# EasyEDA Pro project ProDoc_主板V6.0_2025-09-29.epro, schematic Schematic5_4
Board Name: 主板V6.0; Create Date: 2025-07-02; Page Name: P1; Project Name: 智能车竞赛2025; Schematic Name: Schematic5_4; Update Date: 2025-07-02; Company: 嘉立创EDA; Page Size: A3; Version: V1.0
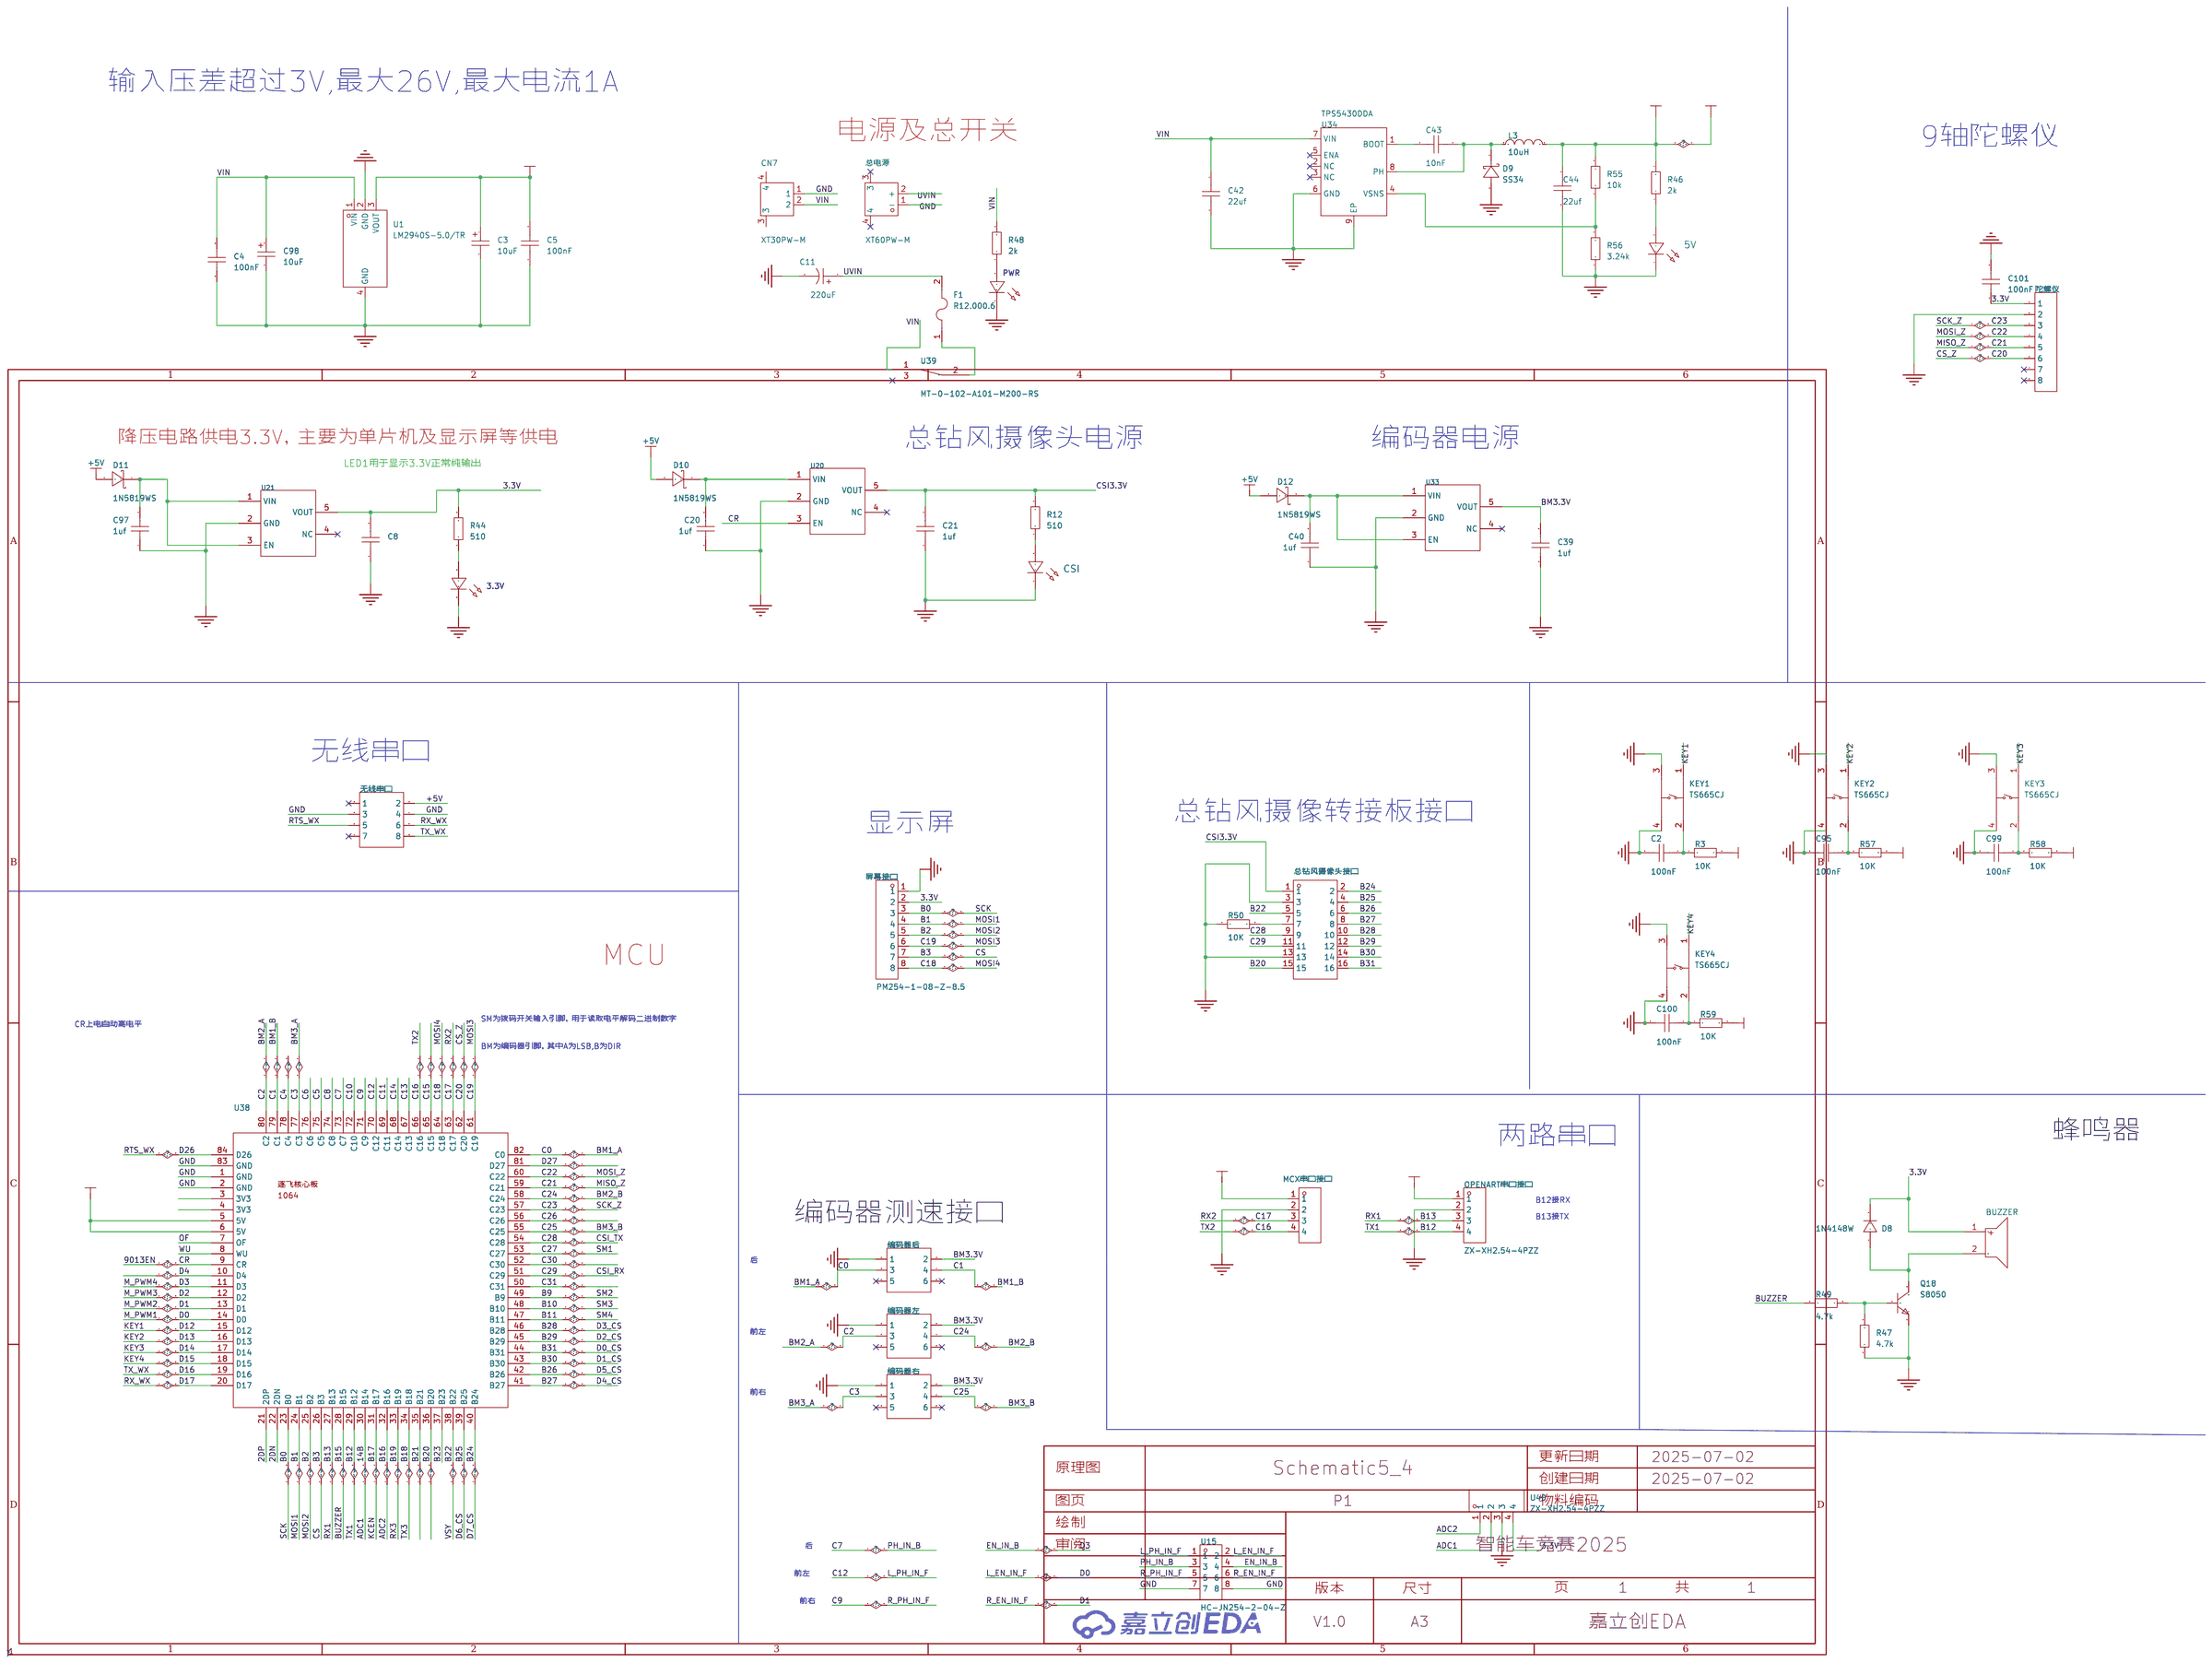
[diagram p0: schematic sheet]

## Parts
3.3V  -  [led_0805]
5V  -  [led_0805]
BUZZER  2.7kHz  [BUZ-SMD_L9.6-W9.6-LS10.0-R]
C2  100nF  [C0603]
C3  10uF  [CAP-SMD_L3.2-W1.6-RD-C7171]
C4  100nF  [C1206]
C5  100nF  [C1206]
C8  1uf  [C0603]
C11  220uF  [CAP-TH_BD8.0-P3.50-D0.5-FD]
C20  1uf  [C0603]
C21  1uf  [C0603]
C39  1uf  [C0603]
C40  1uf  [C0603]
C42  22uf  [C0805]
C43  10nF  [C0805]
C44  22uf  [C0805]
C95  100nF  [C0603]
C97  1uf  [C0603]
C98  10uF  [CAP-SMD_L3.2-W1.6-RD-C7171]
C99  100nF  [C0603]
C100  100nF  [C0603]
C101  100nF  [C0603]
CN7  XT30PW-M  [CONN-TH_XT30PW-M]
CSI  -  [led_0805]
D8  1N4148W  [SOD-123_L2.8-W1.8-LS3.7-RD]
D9  SS34  [SMA_L4.3-W2.5-LS5.0-RD]
D10  1N5819WS  [SOD-323_L1.8-W1.3-LS2.5-RD]
D11  1N5819WS  [SOD-323_L1.8-W1.3-LS2.5-RD]
D12  1N5819WS  [SOD-323_L1.8-W1.3-LS2.5-RD]
F1  R12.000.6  [F1206]
KEY1  TS665CJ  [SW-TH_4P-L6.0-W6.0-P4.50-LS6.5]
KEY2  TS665CJ  [SW-TH_4P-L6.0-W6.0-P4.50-LS6.5]
KEY3  TS665CJ  [SW-TH_4P-L6.0-W6.0-P4.50-LS6.5]
KEY4  TS665CJ  [SW-TH_4P-L6.0-W6.0-P4.50-LS6.5]
L3  10uH  [IND-SMD_L5.4-W5.2_FXL0530]
MCX串口接口  ZX-XH2.54-4PZZ  [CONN-TH_4P-P2.50_4PIN]
OPENART串口接口  ZX-XH2.54-4PZZ  [CONN-TH_4P-P2.50_4PIN]
PWR  -  [led_0805]
Q18  S8050  [SOT-23-3_L2.9-W1.3-P1.90-LS2.4-BR]
R3  10K  [R0603]
R12  510  [R0805]
R44  510  [R0805]
R46  2k  [R0805]
R47  4.7k  [R0805]
R48  2k  [R0805]
R49  4.7k  [R0805]
R50  10K  [R0805]
R55  10k  [R0805]
R56  3.24k  [R0805]
R57  10K  [R0603]
R58  10K  [R0603]
R59  10K  [R0603]
U1  LM2940S-5.0/TR  [TO-263-3_L8.6-W10.2-P2.54-LS14.4-BR]
U15  HC-JN254-2-04-Z  [IDC-TH_8P-P2.54-V-R2-C4-S2.54]
U20  RT9013-33GB  [SOT-23-5_L3.0-W1.7-P0.95-LS2.8-BL]
U21  RT9013-33GB  [SOT-23-5_L3.0-W1.7-P0.95-LS2.8-BL]
U33  RT9013-33GB  [SOT-23-5_L3.0-W1.7-P0.95-LS2.8-BL]
U34  TPS5430DDA  [ESOP-8_L4.9-W3.9-P1.27-LS6.0-BL-EP-2]
U38  -  [NXPRT1064]
U39  MT-0-102-A101-M200-RS  [SW-TH_MT-0-103-A101-M200-RS]
U40  ZX-XH2.54-4PZZ  [CONN-TH_4P-P2.50_4PIN]
屏幕接口  PM254-1-08-Z-8.5  [HDR-TH_8P-P2.54-V-F]
总电源  XT60PW-M  [CONN-TH_XT60PW-M]
总钻风摄像头接口  PM254-2-08-Z-8.5  [HDR-TH_16P-P2.54-V-F-R2-C8-S2.54]
无线串口  -  [HDR-TH_8P-P2.54-V-F-R2-C4-S2.54-1]
编码器右  -  [HDR-TH_6P-P2.54-V-F-R2-C3-S2.54]
编码器后  -  [HDR-TH_6P-P2.54-V-F-R2-C3-S2.54]
编码器左  -  [HDR-TH_6P-P2.54-V-F-R2-C3-S2.54]
陀螺仪  -  [HDR-TH_8P-P2.54-V-F-1]

## Library data of the parts
3.3V = LED_0805-G: Supplier Footprint: 0805
5V CSI = LED_0805-R: Supplier Footprint: 0805
BUZZER = MLT-9650: 驱动方式:有源(内含驱动线路);构造类型:电磁式;频率:2.7kHz;声压(SPL):85dB@5V,10cm;; LCSC Part Name: 耐环保MLT-9650; Supplier Part: C96127; Manufacturer: 华能; JLCPCB Part Class: 扩展库; Datasheet: https://atta.szlcsc.com/upload/public/pdf/source/20170914/C96127_1505374148680969227.pdf; Supplier: LCSC; Oscillator Circuit: 有源(内含驱动线路); Technology Type: 电磁式; Operating Voltage: 3V~7V; Sound Pressure Level (SPL): 85dB@5V,10cm; Length: 9.6mm; Width: 9.6mm; Height: 5.5mm
C2 C8 C20 C21 C39 C40 C95 C97 C99-C101 = CAP_0603: Supplier Footprint: 0603
C3 C98 = TAJA106K016RNJ: 容值:10uF;精度:±10%;额定电压:16V;等效串联电阻:3Ω@100kHz;; LCSC Part Name: 10uF ±10% 16V; Supplier Part: C7171; Manufacturer: Kyocera AVX; Supplier Footprint: CASE-A-3216; JLCPCB Part Class: 基础库; Datasheet: https://atta.szlcsc.com/upload/public/pdf/source/20160107/1457707750344.pdf; Supplier: LCSC; Tolerance: ±10%; Rated Voltage: 16V; Equivalent Series Resistance(ESR): 3Ω@100kHz; Operating Temperature: -55℃~+125℃
C4 C5 = CAP_1206: Supplier Footprint: 1206
C11 = KNH2220UF35V149EC0049: 容值:220uF;精度:±20%;额定电压:35V;纹波电流:1.7A@100kHz;等效串联电阻:40mΩ@100kHz;; LCSC Part Name: 220uF ±20% 35V; Supplier Part: C2981462; Manufacturer: KNSCHA(科尼盛); Supplier Footprint: 插件,D8xL9mm; JLCPCB Part Class: 扩展库; Datasheet: https://atta.szlcsc.com/upload/public/pdf/source/20220426/9FC8A158D93B909CC105160B4A0CB698.pdf; Supplier: LCSC; Tolerance: ±20%; Rated Voltage: 35V; Ripple Current: 1.7A@100kHz; Equivalent Series Resistance(ESR): 40mΩ@100kHz; Lead Spacing: 3.5mm; φD: 8mm; L: 9mm; Lifetime @ Temp: 2000hrs@105℃; Operating Temperature: -55℃~+105℃
C42-C44 = CAP_0805: Supplier Footprint: 0805
CN7 = XT30PW-M: 类别:-;类型1:-;; LCSC Part Name: AMASS(艾迈斯)航模插头 卧式弯脚 XT30PW-M公头; Supplier Part: C431092; Manufacturer: AMASS(艾迈斯); JLCPCB Part Class: 扩展库; Datasheet: https://atta.szlcsc.com/upload/public/pdf/source/20220222/6A9F22F7850E25B33E1BE430ADF8560B.pdf; Supplier: LCSC; Brand: 艾迈斯; Type: 航模插头; RatedVoltage: DC 500V; InterfaceType: 公头; RatedCurrent: 15A; RecommendedWireGauge: 16/18/20AWG; contact resistance: 1.2mΩ; specifications: 2pin
D8 = 1N4148W_C2099: 二极管配置:独立式;正向压降(Vf):1.25V@150mA;直流反向耐压(Vr):100V;平均整流电流(Io):150mA;功率:500mW;反向恢复时间(trr):4ns;; LCSC Part Name: 电压:100V 电流:150mA; Supplier Part: C2099; Manufacturer: CJ(江苏长电/长晶); Supplier Footprint: SOD-123; JLCPCB Part Class: 扩展库; Datasheet: https://atta.szlcsc.com/upload/public/pdf/source/20120428/1457706480199.pdf; Supplier: LCSC; Diode Configuration: 独立式; Forward Voltage (Vf@If): 1.25V@150mA; Reverse Voltage (Vr): 100V; Average Rectified Current (Io): 150mA; Power Dissipation: 500mW; Reverse Leakage Current: 1uA@75V; Reverse Recovery Time (trr): 4ns
D9 = SS34_C727060: 二极管配置:独立式;正向压降(Vf):550mV@3A;直流反向耐压(Vr):40V;平均整流电流(Io):3A;; LCSC Part Name: 电压:40V 电流:3A; Supplier Part: C727060; Manufacturer: TWGMC(台湾迪嘉); Supplier Footprint: SMA(DO-214AC); JLCPCB Part Class: 扩展库; Datasheet: https://atta.szlcsc.com/upload/public/pdf/source/20200828/C727059_6599B6CAC5F3238B9C33E46794659DBE.pdf; Supplier: LCSC; Diode Configuration: 独立式; Forward Voltage (Vf@If): 550mV@3A; Reverse Voltage (Vr): 40V; Average Rectified Current (Io): 3A; Reverse Leakage Current (Ir): 500uA@40V
D10-D12 = 1N5819WS_C191023: 正向压降(Vf):600mV@1A;直流反向耐压(Vr):40V;整流电流:1A;; LCSC Part Name: 电压:40V 电流:1A; Supplier Part: C191023; Manufacturer: Hottech(合科泰); Supplier Footprint: SOD-323; JLCPCB Part Class: 基础库; Datasheet: https://atta.szlcsc.com/upload/public/pdf/source/20220428/3CB86FD8D28D653594B4E35F9D5AEFD9.pdf; Supplier: LCSC; Forward Voltage (Vf@If): 600mV@1A; Reverse Voltage (Vr): 40V; Rectified Current: 1A
F1 = R12.000.6: 类型:贴片式保险丝;额定电流:6A;; LCSC Part Name: 1206快断 48V 6A 贴片保险丝; Supplier Part: C5383191; Manufacturer: Reomax(瑞迈); Supplier Footprint: 1206; JLCPCB Part Class: 扩展库; Datasheet: https://atta.szlcsc.com/upload/public/pdf/source/20230322/8B7334A9365A6D3E55286A2E42090C87.pdf; Supplier: LCSC; Type: 贴片式保险丝; Current Rating: 6A
KEY1-KEY4 = TS665CJ: 电路结构:单刀单掷;按钮形状:圆形按钮;安装方式:直插;开关长度:6mm;开关宽度:6mm;开关高度:5mm;触点电流:50mA;额定电压(DC):12V;带灯:-;机械寿命:-;; LCSC Part Name: 6*6*5mm 直插 轻触开关; Supplier Part: C393938; Manufacturer: SHOU HAN(首韩); Supplier Footprint: 插件; JLCPCB Part Class: 扩展库; Datasheet: https://atta.szlcsc.com/upload/public/pdf/source/20190521/C393938_BDABEAC600B4C55E200A80AA129B70BC.pdf; Supplier: LCSC; Circuit: 单刀单掷; Actuator Style: 圆形按钮; Mounting Style: 直插; Switch Length: 6mm; Switch Width: 6mm; Switch Height: 5mm; Contact Current: 50mA; Voltage Rating (DC): 12V
L3 = FXL0530-100-M: 电感值:10uH;精度:±20%;额定电流:3.2A;饱和电流(Isat):3.5A;类型:一体成型电感;; LCSC Part Name: 10uH ±20% 3.5A; Supplier Part: C177248; Manufacturer: cjiang(长江微电); Supplier Footprint: SMD,5.2x5.4mm; JLCPCB Part Class: 扩展库; Datasheet: https://atta.szlcsc.com/upload/public/pdf/source/20230516/4BF6F9C76E81720F52A39ED5FFFA18B4.pdf; Supplier: LCSC; Tolerance: ±20%; Rated Current: 3.2A; Saturation Current (Isat): 3.5A; DC Resistance (DCR): 125mΩ; Type: 一体成型电感
MCX串口接口 OPENART串口接口 U40 = ZX-XH2.54-4PZZ: 插针结构:1x4P;间距:2.54mm;安装方式:直插;参考系列:XH;总PIN数:4P;排数:1;每排PIN数:4;行距:-;额定电流:3A;触头材质:黄铜;触头镀层:锡;工作温度范围:-25℃~+85℃;; Supplier Part: C7429634; Manufacturer: Megastar(兆星); Supplier Footprint: 插件,P=2.54mm; JLCPCB Part Class: 扩展库; Datasheet: https://atta.szlcsc.com/upload/public/pdf/source/20230619/B529A2163E0159A644AB3383D208FB03.pdf; Supplier: LCSC; Pins Structure: 1x4P; Pitch: 2.54mm; Mounting Style: 直插; Reference Series: XH; Number of Pins: 4P; Number of Rows: 1; Number of PINs Per Row: 4; Current Rating (Max): 3A; Contact Material: 黄铜; Contact Plating: 锡; Operating Temperature Range: -25℃~+85℃
PWR = LED_0805-B: Supplier Footprint: 0805
Q18 = S8050_C2891804: 晶体管类型:NPN;集电极电流(Ic):500mA;集射极击穿电压(Vceo):25V;功率(Pd):300mW;; LCSC Part Name: NPN 电流:500mA 耐压:25V; Supplier Part: C2891804; Manufacturer: YONGYUTAI(永裕泰); Supplier Footprint: SOT-23; JLCPCB Part Class: 扩展库; Datasheet: https://atta.szlcsc.com/upload/public/pdf/source/20210901/5347316A10609C628D4D69AE01446E5B.pdf; Supplier: LCSC; Transistor Type: NPN; Collector Current (Ic): 500mA; Collector-Emitter Breakdown Voltage (Vceo): 25V; Power Dissipation (Pd): 300mW; Collector Cut-Off Current (Icbo): 1uA; Collector-Emitter Saturation Voltage (VCE(sat)@Ic,Ib): 500mV@500mA,50mA
R3 R48 R57-R59 = Res_0603: Supplier Footprint: 0603
R12 R44 R46 R47 R49 R50 R55 R56 = Res_0805: Supplier Footprint: 0805
U1 = LM2940S-5.0/TR: 输出类型:固定;最大输入电压:26V;输出电压:5V;最大输出电流:1A;电源纹波抑制比(PSRR):60dB@(120Hz);输出极性:正极;; LCSC Part Name: 输入26V 输出5V 1A; Supplier Part: C434496; Manufacturer: HGSEMI(华冠); Supplier Footprint: TO-263-3L; JLCPCB Part Class: 扩展库; Datasheet: https://atta.szlcsc.com/upload/public/pdf/source/20220118/FAC7234A0BE9BED821FF13FB6224EF1A.pdf; Supplier: LCSC; Output Type: 固定; Maximum Input Voltage: 26V; Output Voltage: 5V; MAX Output Current: 1A; Power Supply Rejection Ratio (PSRR): 60dB@(120Hz); Dropout Voltage: 1V@(1A); Output Polarity: 正极; Number of Outputs: 1
U15 = HC-JN254-2-04-Z: 连接器类型:简牛座;间距:2.54mm;结构:2x4P;额定电流:3A;额定电压:-;封装形式:直插;行距:2.54mm;排数:2;每排PIN数:4;触头材质:黄铜;触头镀层:金;工作温度范围:-40℃~+105℃;焊接温度(最大值):260℃@10S;; LCSC Part Name: 2.54mm 2x4P 排数:2 每排P数:4; Supplier Part: C5372864; Manufacturer: HCTL(华灿天禄); Supplier Footprint: 插件,P=2.54mm; JLCPCB Part Class: 扩展库; Datasheet: https://atta.szlcsc.com/upload/public/pdf/source/20230314/29278A24539954283B80828B9C32CD4C.pdf; Supplier: LCSC; Connector Type: 简牛座; Pitch: 2.54mm; Structure: 2x4P; Current Rating (Max): 3A; Holder Type: 直插; Row Spacing: 2.54mm; Number of Rows: 2; Pin Number in each Row: 4; Contact Material: 黄铜; Contact Plating: 金; Operating Temperature Range: -40℃~+105℃; Soldering Temperature(Max): 260℃@10S
U20 U21 U33 = RT9013-33GB: 输出类型:固定;输出极性:正;最大输入电压:5.5V;输出电压:3.3V;输出电流:500mA;电源纹波抑制比(PSRR):50dB@(10kHz);; LCSC Part Name: 输入5.5V 输出3.3V 500mA; Supplier Part: C47773; Manufacturer: RICHTEK(立锜); Supplier Footprint: SOT-23-5; JLCPCB Part Class: 扩展库; Datasheet: https://atta.szlcsc.com/upload/public/pdf/source/20150504/1457707282459.pdf; Supplier: LCSC; Output Type: 固定; Output Polarity: 正; Number of Outputs: 1; Maximum Input Voltage: 5.5V; Output Voltage: 3.3V; Dropout Voltage: 400mV@(500mA); Quiescent Current (Ground Current): 50uA; Output Current: 500mA; Power Supply Rejection Ratio (PSRR): 50dB@(10kHz); Operating Temperature: -40℃~+85℃
U34 = TPS5430DDA: 功能类型:降压型;输出类型:可调;输入电压:5.5V~36V;输出电压:1.221V~32.04V;输出电流(最大值):3A;; LCSC Part Name: 降压 3A 36V; Supplier Part: C502477; Manufacturer: TI(德州仪器); Supplier Footprint: ESOP-8; JLCPCB Part Class: 扩展库; Datasheet: https://www.ti.com/cn/lit/gpn/tps5430; Supplier: LCSC; Function: 降压型; Output Type: 可调; Input Voltage: 5.5V~36V; Output Voltage: 1.221V~32.04V; Output Current (Max): 3A; Switching Frequency: 500kHz; Operating Temperature: -40℃~+125℃@(TJ); Synchronous Rectification: 否; Number of Outputs: 1; Topology: 降压式; Switch tube (built-in/external): 内置
U38 = NXP_1064
U39 = MT-0-102-A101-M200-RS: 电路结构:单刀双掷;机械寿命:-;额定电流:5A;额定电压(AC):125V;安装方式:直插;; LCSC Part Name: 小型钮子三脚二档 五件套; Supplier Part: C1788492; Manufacturer: YUEN FUNG(源丰); Supplier Footprint: 插件; JLCPCB Part Class: 扩展库; Datasheet: https://atta.szlcsc.com/upload/public/pdf/source/20230720/8E5C36EFDF374AE4FF4AC09DB233CE0E.pdf; Supplier: LCSC; Circuit: 单刀双掷; Switch Length: 13mm; Switch Width: 8mm; Switch Height: 28.6mm; Contact Current: 5A; Voltage Rating (AC): 125V; Actuator Type: 圆柱钮柄; Pin Style: 焊片; Mounting Style: 直插; Operating Temperature: -25℃~+85℃
屏幕接口 = PM254-1-08-Z-8.5: 排数:单排;总孔位数:8P;间距:2.54mm;插孔结构:1x8P;行距:-;安装类型:直插;圆孔/方孔:方孔;额定电流:3A;额定电压:-;插孔方向:顶部;塑高:8.5mm;工作温度范围:-40℃~+105℃;; LCSC Part Name: 间距:2.54mm 1x8P 直插; Supplier Part: C2897371; Manufacturer: HCTL(华灿天禄); Supplier Footprint: 插件,P=2.54mm; JLCPCB Part Class: 扩展库; Datasheet: https://atta.szlcsc.com/upload/public/pdf/source/20230609/534BE42964C679BDE98E061007C4ABD6.pdf; Supplier: LCSC; Number of Rows: 单排; Number of Holes: 8P; Pitch: 2.54mm; Holes Structure: 1x8P; Mounting Type: 直插; Circular Hole / Square Hole: 方孔; Current Rating (Max): 3A; Holes Direction: 顶部; Insulation Height: 8.5mm; Operating Temperature Range: -40℃~+105℃
总电源 = XT60PW-M: 类别:-;类型1:-;; LCSC Part Name: AMASS(艾迈斯)航模插头xt60连接器150公母对接pw锂电池公头 板插卧式XT60PW-M; Supplier Part: C98732; Manufacturer: AMASS(艾迈斯); JLCPCB Part Class: 扩展库; Datasheet: https://atta.szlcsc.com/upload/public/pdf/source/20240118/44A3DCFF53BE25DC65378AFFB21277A4.pdf; Supplier: LCSC; Brand: 艾迈斯; Type: 卧式插头; Colour: 黄色; InterfaceType: 公头
总钻风摄像头接口 = PM254-2-08-Z-8.5: 排数:双排;总孔位数:16P;间距:2.54mm;插孔结构:2x8P;行距:2.54mm;安装类型:直插;圆孔/方孔:方孔;额定电流:3A;额定电压:-;插孔方向:顶部;塑高:8.5mm;工作温度范围:-40℃~+105℃;; LCSC Part Name: 间距:2.54mm 2x8P 直插; Supplier Part: C2897409; Manufacturer: HCTL(华灿天禄); Supplier Footprint: 插件,P=2.54mm; JLCPCB Part Class: 扩展库; Datasheet: https://atta.szlcsc.com/upload/public/pdf/source/20230609/3D36CA2C1BFC9FD1C3F709AD9DFEB9C2.pdf; Supplier: LCSC; Number of Rows: 双排; Number of Holes: 16P; Pitch: 2.54mm; Holes Structure: 2x8P; Row Spacing: 2.54mm; Mounting Type: 直插; Circular Hole / Square Hole: 方孔; Current Rating (Max): 3A; Holes Direction: 顶部; Insulation Height: 8.5mm; Operating Temperature Range: -40℃~+105℃
无线串口 = HDR-F_2.54_2x4: Supplier Part: C92271; Supplier Footprint: 插件
编码器右 编码器后 编码器左 = HDR-F_2.54_2x3: Supplier Part: C92272; Supplier Footprint: 插件
陀螺仪 = HDR-F_2.54_1x8P: Supplier Part: C27438; Supplier Footprint: 插件

## Nets
3.3V: BUZZER.1 C8.2 C101.1 D8.1(K) R3.2 R44.2 R57.2 R58.2 R59.2 U21.5(VOUT) U40.4 屏幕接口.2 陀螺仪.1
+5V: C44.1 D10.2(A) D11.2(A) D12.2(A) L3.2 MCX串口接口.1 OPENART串口接口.1 R46.2 R55.2 无线串口.2
+5V_1064: C3.1 C5.2 U1.3(VOUT) U38.5(5V) U38.6(5V)
GND: 3.3V.1(C) 5V.1(C) C2.2 C3.2 C4.1 C5.1 C8.1 C11.2 C20.1 C21.1 C39.1 C40.1 C42.2 C44.2 C95.2 C97.1 C98.2 C99.2 C100.2 C101.2 CN7.1 CSI.1(C) D9.2(A) KEY1.3(C) KEY1.4(D) KEY2.3(C) KEY2.4(D) KEY3.3(C) KEY3.4(D) KEY4.3(C) KEY4.4(D) MCX串口接口.2 OPENART串口接口.2 PWR.1(C) Q18.2(E) R47.1 R50.1 R56.1 U1.2(GND) U1.4(GND) U15.7 U15.8 U20.2(GND) U21.2(GND) U33.2(GND) U34.6(GND) U34.9(EP) U38.1(GND) U38.2(GND) U38.83(GND) U40.3 屏幕接口.1 总电源.1(-) 总钻风摄像头接口.3 总钻风摄像头接口.13 无线串口.3 无线串口.4 编码器右.1 编码器后.1 编码器左.1 陀螺仪.2
VIN: C4.2 C42.1 C98.1 CN7.2 R48.2 U1.1(VIN) U34.7(VIN) U39.1
2DN: U38.22(2DN)
2DP: U38.21(2DP)
14B: U38.30(B14) U40.2
9013EN: U20.3(EN) U38.9(CR)
ADC2: U38.32(B16) U40.1
B0: U38.23(B0) 屏幕接口.3
B1: U38.24(B1) 屏幕接口.4
B2: U38.25(B2) 屏幕接口.5
B3: U38.26(B3) 屏幕接口.7
B9: U38.49(B9)
B10: U38.48(B10)
B11: U38.47(B11)
B12: OPENART串口接口.4 U38.29(B12)
B13: OPENART串口接口.3 U38.27(B13)
B15: R49.1 U38.28(B15)
B17: U38.31(B17)
B18: U38.34(B18)
B19: U38.33(B19)
B20: U38.36(B20) 总钻风摄像头接口.15
B21: U38.35(B21)
B22: U38.38(B22) 总钻风摄像头接口.5
B23: U38.37(B23)
B24: U38.40(B24) 总钻风摄像头接口.2
B25: U38.39(B25) 总钻风摄像头接口.4
B26: U38.42(B26) 总钻风摄像头接口.6
B27: U38.41(B27) 总钻风摄像头接口.8
B28: U38.46(B28) 总钻风摄像头接口.10
B29: U38.45(B29) 总钻风摄像头接口.12
B30: U38.43(B30) 总钻风摄像头接口.14
B31: U38.44(B31) 总钻风摄像头接口.16
BM1_A: U38.82(C0) 编码器后.3
BM1_B: U38.79(C1) 编码器后.4
BM2_A: U38.80(C2) 编码器左.3
BM2_B: U38.58(C24) 编码器左.4
BM3.3V: C39.2 U33.5(VOUT) 编码器右.2 编码器后.2 编码器左.2
BM3_A: U38.77(C3) 编码器右.3
BM3_B: U38.55(C25) 编码器右.4
C4: U38.78(C4)
C5: U38.75(C5)
C6: U38.76(C6)
C7: U15.3 U38.73(C7)
C8: U38.74(C8)
C9: U15.5 U38.71(C9)
C10: U38.72(C10)
C11: U38.69(C11)
C12: U15.1 U38.70(C12)
C13: U38.67(C13)
C14: U38.68(C14)
C15: U38.65(C15)
C16: MCX串口接口.4 U38.66(C16)
C17: MCX串口接口.3 U38.63(C17)
C18: U38.64(C18) 屏幕接口.8
C19: U38.61(C19) 屏幕接口.6
C20: U38.62(C20) 陀螺仪.6
C21: U38.59(C21) 陀螺仪.5
C22: U38.60(C22) 陀螺仪.4
C23: U38.57(C23) 陀螺仪.3
C26: U38.56(C26)
C27: U38.53(C27)
C28: U38.54(C28) 总钻风摄像头接口.9
C29: U38.51(C29) 总钻风摄像头接口.11
C30: U38.52(C30)
C31: U38.50(C31)
CSI3.3V: C21.2 R12.2 U20.5(VOUT) 总钻风摄像头接口.1
D0: U15.2 U38.14(D0)
D1: U15.6 U38.13(D1)
D2: U38.12(D2)
D3: U15.4 U38.11(D3)
D4: U38.10(D4)
D12: KEY1.1(A) U38.15(D12)
D13: KEY2.1(A) U38.16(D13)
D14: KEY3.1(A) U38.17(D14)
D15: KEY4.1(A) U38.18(D15)
D16: U38.19(D16) 无线串口.8
D17: U38.20(D17) 无线串口.6
D26: U38.84(D26) 无线串口.5
D27: U38.81(D27)
OF: U38.7(OF)
UVIN: C11.1 F1.2 总电源.2(+)
WU: U38.8(WU)
$1N3498: PWR.2(A) R48.1
$1N3640: R50.2 总钻风摄像头接口.7
$1N3710: Q18.1(B) R47.2 R49.2
$1N3711: BUZZER.2 D8.2(A) Q18.3(C)
$1N3941: C40.2 D12.1(K) U33.1(VIN) U33.3(EN)
$1N3969: C97.2 D11.1(K) U21.1(VIN) U21.3(EN)
$1N3994: 3.3V.2(A) R44.1
$1N4005: CSI.2(A) R12.1
$1N4007: F1.1 U39.2
$1N9076: 5V.2(A) R46.1
$1N9079: C43.1 U34.1(BOOT)
$1N9081: C43.2 D9.1(C) L3.1 U34.8(PH)
$1N9082: R55.1 R56.2 U34.4(VSNS)
$1N17911: C20.2 D10.1(K) U20.1(VIN)
$1N37221: C2.1 KEY1.2(B) R3.1
$1N37227: C95.1 KEY2.2(B) R57.1
$1N37371: C99.1 KEY3.2(B) R58.1
$1N37512: C100.1 KEY4.2(B) R59.1

Not connected (* = marked no-connect by the designer): CN7 3 4; U20 4(NC)*; U21 4(NC)*; U33 4(NC)*; U34 2(NC)* 3(NC)* 5(ENA)*; U38 3(3V3) 4(3V3); U39 3*; 总电源 3* 4*; 无线串口 1* 7*; 编码器右 5* 6*; 编码器后 5* 6*; 编码器左 5* 6*; 陀螺仪 7* 8*

## Notes on the sheet
- 输入压差超过3V,最大26V,最大电流1A
- 电源及总开关
- 9轴陀螺仪
- 降压电路供电3.3V，主要为单片机及显示屏等供电
- 总钻风摄像头电源
- 编码器电源
- LED1用于显示3.3V正常纯输出
- 无线串口
- 总钻风摄像转接板接口
- 显示屏
- MCU
- SM为拨码开关输入引脚，用于读取电平解码二进制数字
- CR上电自动高电平
- BM为编码器引脚，其中A为LSB,B为DIR
- 两路串口
- 蜂鸣器
- B12接RX
- 编码器测速接口
- B13接TX
- 后
- 前左
- 前右
- 后
- 前左
- 前右
